# Altium schematic sheet THERMO_RTD_SENSOR_2CH.SchDoc: 2CH RTD Sensor
size A3; Author: M.Beldyga; CompanyName: WUT ISE; DrawnBy: M.Beldyga; Organization: WUT ISE; Address1: PW ISE; Address2: Nowowiejska 15/19 00-665 Warsaw; Address3: micbeldyga@gmail.com; SheetNumber: 1; SheetTotal: 2; ModifiedBy: -; CheckedDate: -; Title2: MODULIQ; DivGrp: WUT ISE; Designer: M.Beldyga; ModifiedDate: -; ProjectName: Sensor Box
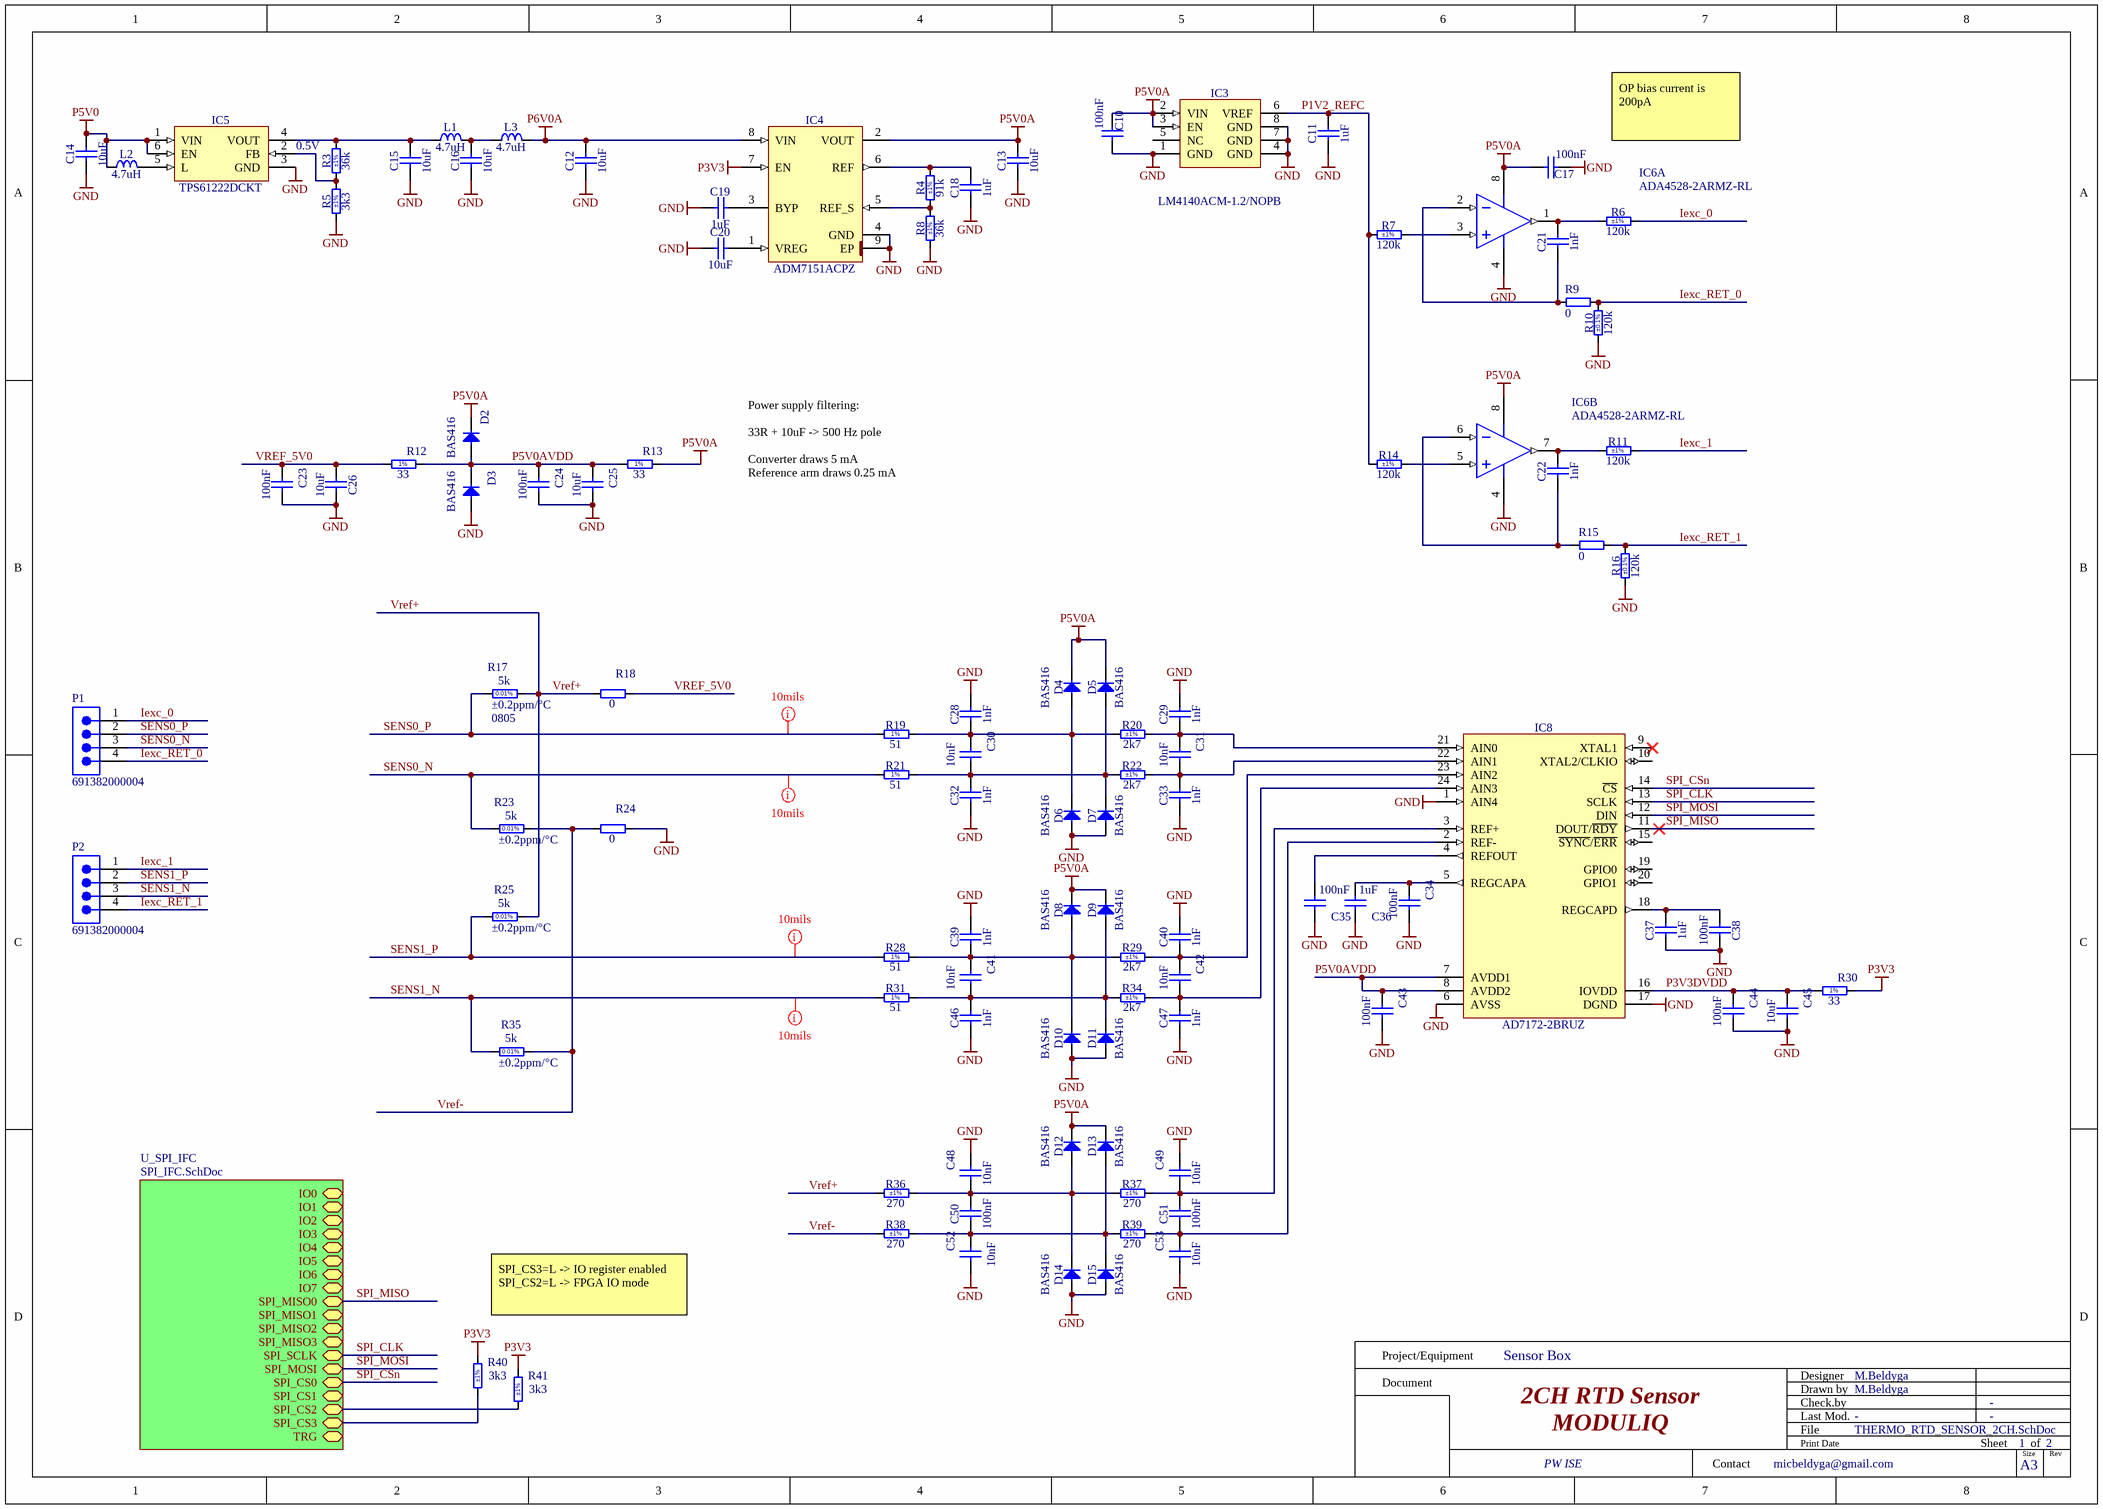
[diagram p0: THERMO_RTD_SENSOR_2CH.SchDoc]

## Parts
C10  100nF  [CAPC1005X55N]
C11  1uF  [CAPC1608X87N]
C12  10uF  [CAPC1608X80N]
C13  10uF  [CAPC1608X80N]
C14  10uF  [CAPC1608X80N]
C15  10uF  [CAPC1608X80N]
C16  10uF  [CAPC1608X80N]
C17  100nF  [CAPC1005X55N]
C18  1uF  [CAPC1005X55N]
C19  1uF  [CAPC1005X55N]
C20  10uF  [CAPC1608X80N]
C21  1nF  [CAPC1005X55N]
C22  1nF  [CAPC1005X55N]
C23  100nF  [CAPC1005X55N]
C24  100nF  [CAPC1005X55N]
C25  10uF  [CAPC2012X135N]
C26  10uF  [CAPC2012X135N]
C28  1nF  [CAPC1608X90N]
C29  1nF  [CAPC1608X90N]
C30  10nF  [CAPC1608X87N]
C31  10nF  [CAPC1608X87N]
C32  1nF  [CAPC1608X90N]
C33  1nF  [CAPC1608X90N]
C34  100nF  [CAPC1005X55N]
C35  100nF  [CAPC1005X55N]
C36  1uF  [CAPC1608X87N]
C37  1uF  [CAPC1608X87N]
C38  100nF  [CAPC1005X55N]
C39  1nF  [CAPC1608X90N]
C40  1nF  [CAPC1608X90N]
C41  10nF  [CAPC1608X87N]
C42  10nF  [CAPC1608X87N]
C43  100nF  [CAPC1005X55N]
C44  100nF  [CAPC1005X55N]
C45  10uF  [CAPC2012X135N]
C46  1nF  [CAPC1608X90N]
C47  1nF  [CAPC1608X90N]
C48  10nF  [CAPC1608X87N]
C49  10nF  [CAPC1608X87N]
C50  100nF  [CAPC1608X87N]
C51  100nF  [CAPC1608X87N]
C52  10nF  [CAPC1608X87N]
C53  10nF  [CAPC1608X87N]
D2  BAS416  [SOD2512X110N]
D3  BAS416  [SOD2512X110N]
D4  BAS416  [SOD2512X110N]
D5  BAS416  [SOD2512X110N]
D6  BAS416  [SOD2512X110N]
D7  BAS416  [SOD2512X110N]
D8  BAS416  [SOD2512X110N]
D9  BAS416  [SOD2512X110N]
D10  BAS416  [SOD2512X110N]
D11  BAS416  [SOD2512X110N]
D12  BAS416  [SOD2512X110N]
D13  BAS416  [SOD2512X110N]
D14  BAS416  [SOD2512X110N]
D15  BAS416  [SOD2512X110N]
IC3  LM4140ACM-1.2/NOPB  [SOIC127P600X175-8N]
IC4  ADM7151ACPZ  [SON50P300X300X80-9N-R170X244]
IC5  TPS61222DCKT  [SOT65P210X110-6N]
IC6  ADA4528-2ARMZ-RL  [ADI-RM-8_N]  (parts A,B of 2)
IC8  AD7172-2BRUZ  [SOP65P640X120-24N]
L1  4.7uH  [INDC2520X120N]
L2  4.7uH  [INDC2520X120N]
L3  4.7uH  [INDC2520X120N]
P1  691382000004  [691382000004]
P2  691382000004  [691382000004]
R3  36k  Tolerance: ±1%  [RESC1005X40N]
R4  91k  Tolerance: ±1%  [RESC1005X40N]
R5  3k3  Tolerance: ±1%  [RESC1005X40N]
R6  120k  Tolerance: ±1%  [RESC1005X40N]
R7  120k  Tolerance: ±1%  [RESC1005X40N]
R8  36k  Tolerance: ±1%  [RESC1005X40N]
R9  0  [RESC1005X40N]
R10  120k  Tolerance: ±0.1%  [RESC2012X60N]
R11  120k  Tolerance: ±1%  [RESC1005X40N]
R12  33  [RESC1005X40N]
R13  33  [RESC1005X40N]
R14  120k  Tolerance: ±1%  [RESC1005X40N]
R15  0  [RESC1005X40N]
R16  120k  Tolerance: ±0.1%  [RESC2012X60N]
R17  5k  TC: ±0.2ppm/°C  Case: 0805  [RESC2013X64N]
R18  0  [RESC1608X55N]
R19  51  [RESC1005X40N]
R20  2k7  Tolerance: ±1%  [RESC1005X40N]
R21  51  [RESC1005X40N]
R22  2k7  Tolerance: ±1%  [RESC1005X40N]
R23  5k  TC: ±0.2ppm/°C  [RESC2013X64N]
R24  0  [RESC1608X55N]
R25  5k  TC: ±0.2ppm/°C  [RESC2013X64N]
R28  51  [RESC1005X40N]
R29  2k7  Tolerance: ±1%  [RESC1005X40N]
R30  33  [RESC1005X40N]
R31  51  [RESC1005X40N]
R34  2k7  Tolerance: ±1%  [RESC1005X40N]
R35  5k  TC: ±0.2ppm/°C  [RESC2013X64N]
R36  270  Tolerance: ±1%  [RESC1005X40N]
R37  270  Tolerance: ±1%  [RESC1005X40N]
R38  270  Tolerance: ±1%  [RESC1005X40N]
R39  270  Tolerance: ±1%  [RESC1005X40N]
R40  3k3  Tolerance: ±1%  [RESC1005X40N]
R41  3k3  Tolerance: ±1%  [RESC1005X40N]

## Sub-sheets
U_SPI_IFC = SPI_IFC.SchDoc: IO0 (bidir), IO1 (bidir), IO2 (bidir), IO3 (bidir), IO4 (bidir), IO5 (bidir), IO6 (bidir), IO7 (bidir), SPI_MISO0 (bidir), SPI_MISO1 (bidir), SPI_MISO2 (bidir), SPI_MISO3 (bidir), SPI_SCLK (bidir), SPI_MOSI (bidir), SPI_CS0 (bidir), SPI_CS1 (bidir), SPI_CS2 (bidir), SPI_CS3 (bidir), TRG (bidir)

## Nets
GND: C10.2 C11.1 C12.1 C13.1 C14.1 C15.1 C16.1 C17.1 C18.1 C19.1 C20.1 C23.2 C24.2 C25.2 C26.2 C28.2 C29.2 C32.1 C33.1 C34.2 C35.2 C36.1 C37.1 C38.2 C39.2 C40.2 C43.2 C44.2 C45.2 C46.1 C47.1 C48.2 C49.2 C52.1 C53.1 D3.2(A) D6.2(A) D7.2(A) D10.2(A) D11.2(A) D14.2(A) D15.2(A) IC3.1(GND) IC3.4(GND) IC3.7(GND) IC3.8(GND) IC4.4(GND) IC4.9(EP) IC5.3(GND) IC6.4(-V) IC8.1(AIN4) IC8.6(AVSS) IC8.17(DGND) R5.1 R8.1 R10.1 R16.1 R24.2
P3V3: IC4.7(EN) R30.2 R40.1 R41.1
P5V0: C14.2 IC5.1(VIN) IC5.6(EN) L2.1
P5V0A: C10.1 C13.2 C17.2 D2.1(C) D4.1(C) D5.1(C) D8.1(C) D9.1(C) D12.1(C) D13.1(C) IC3.2(VIN) IC3.3(EN) IC4.2(VOUT) IC6.8(+V) R13.2
P6V0A: C12.2 IC4.8(VIN) L3.2
Iexc_0: P1.1 R6.2
Iexc_1: P2.1 R11.2
Iexc_RET_0: P1.4 R9.2 R10.2
Iexc_RET_1: P2.4 R15.2 R16.2
P1V2_REFC: C11.2 IC3.6(VREF) R7.1 R14.1
P3V3DVDD: C44.1 C45.1 IC8.16(IOVDD) R30.1
P5V0AVDD: C24.1 C25.1 C43.1 D2.2(A) D3.1(C) IC8.7(AVDD1) IC8.8(AVDD2) R12.2 R13.1
SENS0_N: P1.3 R21.1 R23.1
SENS0_P: P1.2 R17.1 R19.1
SENS1_N: P2.3 R31.1 R35.1
SENS1_P: P2.2 R25.1 R28.1
SPI_CLK: IC8.13(SCLK) ; sheet U_SPI_IFC/SPI_SCLK
SPI_CSn: IC8.14(~{CS}) ; sheet U_SPI_IFC/SPI_CS0
SPI_MISO: IC8.11(DOUT/~{RDY}) ; sheet U_SPI_IFC/SPI_MISO0
SPI_MOSI: IC8.12(DIN) ; sheet U_SPI_IFC/SPI_MOSI
Vref+: R17.2 R18.1 R25.2 R36.1
Vref-: R23.2 R24.1 R35.2 R38.1
VREF_5V0: C23.1 C26.1 R12.1 R18.2
NetC15_2: C15.2 IC5.4(VOUT) L1.1 R3.2
NetC16_2: C16.2 L1.2 L3.1
NetC18_2: C18.2 IC4.6(REF) R4.2
NetC19_2: C19.2 IC4.3(BYP)
NetC20_2: C20.2 IC4.1(VREG)
NetC21_1: C21.1 IC6.2(-IN_A) R9.1
NetC21_2: C21.2 IC6.1(OUT_A) R6.1
NetC22_1: C22.1 IC6.6(-IN_B) R15.1
NetC22_2: C22.2 IC6.7(OUT_B) R11.1
NetC28_1: C28.1 C30.1 D4.2(A) D6.1(C) R19.2 R20.1
NetC29_1: C29.1 C31.1 IC8.21(AIN0) R20.2
NetC30_2: C30.2 C32.2 D5.2(A) D7.1(C) R21.2 R22.1
NetC31_2: C31.2 C33.2 IC8.22(AIN1) R22.2
NetC34_1: C34.1 C36.2 IC8.5(REGCAPA)
NetC35_1: C35.1 IC8.4(REFOUT)
NetC37_2: C37.2 C38.1 IC8.18(REGCAPD)
NetC39_1: C39.1 C41.1 D8.2(A) D10.1(C) R28.2 R29.1
NetC40_1: C40.1 C42.1 IC8.23(AIN2) R29.2
NetC41_2: C41.2 C46.2 D9.2(A) D11.1(C) R31.2 R34.1
NetC42_2: C42.2 C47.2 IC8.24(AIN3) R34.2
NetC48_1: C48.1 C50.2 D12.2(A) D14.1(C) R36.2 R37.1
NetC49_1: C49.1 C51.2 IC8.3(REF+) R37.2
NetC50_1: C50.1 C52.2 D13.2(A) D15.1(C) R38.2 R39.1
NetC51_1: C51.1 C53.2 IC8.2(REF-) R39.2
NetIC4_5: IC4.5(REF_S) R4.1 R8.2
NetIC5_2: IC5.2(FB) R3.1 R5.2
NetIC5_5: IC5.5(L) L2.2
NetIC6_3: IC6.3(+IN_A) R7.2
NetIC6_5: IC6.5(+IN_B) R14.2
NetR40_2: R40.2 ; sheet U_SPI_IFC/SPI_CS3
NetR41_2: R41.2 ; sheet U_SPI_IFC/SPI_CS2

Not connected (* = marked no-connect by the designer): IC3 5(NC); IC8 9(XTAL1)* 10(XTAL2/CLKIO) 15(~{SYNC}/~{ERR}) 19(GPIO0) 20(GPIO1)

## Layout directives
rule Width Constraint [Pref Width = 10mil    Min Width = 10mil    Max Width = 15mil]: SENS0_N, SENS0_P, SENS1_N, SENS1_P

## Notes on the sheet
- 0.5V
- OP bias current is 200pA
- Power supply filtering:
  33R + 10uF -> 500 Hz pole
  Converter draws 5 mA
  Reference arm draws 0.25 mA
- SPI_CS3=L -> IO register enabled
  SPI_CS2=L -> FPGA IO mode
- Project/Equipment
- Document
- Designer
- Drawn by
- Check.by
- Contact
- File
- Last Mod.
- Print Date
- Sheet
- Size
- A3
- of
- Rev
- (in symbol R0402_33R_1%_0.0625W_100PPM) 1%
- (in symbol R0402_51R_1%_0.0625W_100PPM) 1%
- (in symbol R0805_5K_0.01%_0.2W_0.2PPM_VISHAY_VSMP) 0.01%

## Library data of the parts
C10 C17 = CC0402_100NF_16V_10%_X5R: Non-polarised capacitor; Part Description: SMD Multilayer Chip Ceramic Capacitor; Manufacturer: GENERIC; Manufacturer1 Part Number: GRM155R61C104KA88D; Voltage: 16V; TC: X5R; Tolerance: ±10%; Part Number: CC0402_100NF_16V_10%_X5R; Component Kind: Standard; Component Type: Standard; Pin Count: 2; Value: 100nF; Status: None; Manufacturer Part Number: CC0402_100NF_16V_10%_X5R; Case: 0402; Mounted: Yes; Socket: No; SMD: Yes; Sense: No; Manufacturer1 Example: MURATA; Manufacturer1 ComponentHeight: 0.55mm; HelpURL: \\cern.ch\dfs\Applications\Altium\Datasheets\CC0402_X5R_MURATA_GRM.pdf; Author: CERN DEM JLC; CreateDate: 10.12.2013; LatestRevisionDate: 10.12.2013
C11 C36 C37 = CC0603_1UF_25V_10%_X7R: Non-polarised capacitor; Part Description: SMD Multilayer Chip Ceramic Capacitor; Manufacturer: GENERIC; Manufacturer1 Part Number: GRM188R71E105KA12D; Voltage: 25V; TC: X7R; Tolerance: ±10%; Part Number: CC0603_1UF_25V_10%_X7R; Component Kind: Standard; Component Type: Standard; Pin Count: 2; Value: 1uF; Status: None; Manufacturer Part Number: CC0603_1UF_25V_10%_X7R; Case: 0603; Mounted: Yes; Socket: No; SMD: Yes; Sense: No; Manufacturer1 Example: MURATA; Manufacturer1 ComponentHeight: 0.9mm; HelpURL: \\cern.ch\dfs\Applications\Altium\Datasheets\CC0603_X7R_MURATA.pdf; Author: CERN DEM JLC; CreateDate: 18/01/2011; LatestRevisionDate: 18/01/2011
C12-C16 C20 = CC0603_10UF_10V_10%_X5R: Non-polarised capacitor; Part Description: SMD Multilayer Chip Ceramic Capacitor; Manufacturer: GENERIC; Manufacturer1 Part Number: GRM188R61A106KE69D; Voltage: 10V; TC: X5R; Tolerance: ±10%; Part Number: CC0603_10UF_10V_10%_X5R; Component Kind: Standard; Component Type: Standard; Pin Count: 2; Value: 10uF; Status: None; Manufacturer Part Number: CC0603_10UF_10V_10%_X5R; Case: 0603; Mounted: Yes; Socket: No; SMD: Yes; Sense: No; Manufacturer1 Example: MURATA; Manufacturer1 ComponentHeight: 0.8mm; HelpURL: \\cern.ch\dfs\Applications\Altium\Datasheets\CC0603_MURATA_GRM188R61A106KE69D.pdf; Author: CERN DEM JLC; CreateDate: 31.01.2017; LatestRevisionDate: 31.01.2017
C18 C19 = CC0402_1UF_16V_10%_X5R: Non-polarised capacitor; Part Description: SMD Multilayer Chip Ceramic Capacitor; Manufacturer: GENERIC; Manufacturer1 Part Number: C1005X5R1C105KT; Voltage: 16V; TC: X5R; Tolerance: ±10%; Part Number: CC0402_1UF_16V_10%_X5R; Component Kind: Standard; Component Type: Standard; Pin Count: 2; Value: 1uF; Status: Preferred; Manufacturer Part Number: CC0402_1UF_16V_10%_X5R; Case: 0402; Mounted: Yes; Socket: No; SMD: Yes; Sense: No; Manufacturer1 Example: TDK; Manufacturer1 ComponentHeight: 0.55mm; HelpURL: \\cern.ch\dfs\Applications\Altium\Datasheets\CC0402_X5R_TDK_C.pdf; Author: CERN DEM JLC; CreateDate: 25.10.2012; LatestRevisionDate: 25.10.2012
C21 C22 = CC0402_1NF_50V_10%_X7R: Non-polarised capacitor; Part Description: SMD Multilayer Chip Ceramic Capacitor; Manufacturer: GENERIC; Manufacturer1 Part Number: 223858715623; Voltage: 50V; TC: X7R; Tolerance: ±10%; Part Number: CC0402_1NF_50V_10%_X7R; Component Kind: Standard; Component Type: Standard; Pin Count: 2; Value: 1nF; Status: Not Recommended; Manufacturer Part Number: CC0402_1NF_50V_10%_X7R; Case: 0402; Mounted: Yes; Socket: No; SMD: Yes; Sense: No; Manufacturer1 Example: PHYCOMP; Manufacturer1 ComponentHeight: 0.55mm; HelpURL: \\cern.ch\dfs\Applications\Altium\Datasheets\CC0402_X7R_PHYCOMP.pdf; Author: CERN DEM JLC; CreateDate: 03/12/2007; LatestRevisionDate: 03/12/2007
C23 C24 C34 C35 C38 C43 C44 = CC0402_100NF_16V_10%_X5R: Non-polarised capacitor; Part Description: SMD Multilayer Chip Ceramic Capacitor; Manufacturer: GENERIC; Manufacturer1 Part Number: GRM155R61C104KA88D; Voltage: 16V; TC: X5R; Tolerance: ±10%; Table: Capacitors SMD; Part Number: CC0402_100NF_16V_10%_X5R; Component Kind: Standard; Component Type: Standard; Pin Count: 2; Value: 100nF; Status: None; Manufacturer Part Number: CC0402_100NF_16V_10%_X5R; Case: 0402; Mounted: Yes; Socket: No; SMD: Yes; Manufacturer1 Example: MURATA; Manufacturer1 ComponentHeight: 0.55mm; HelpURL: \\cern.ch\dfs\Applications\Altium\Datasheets\CC0402_X5R_MURATA_GRM.pdf; Author: CERN DEM JLC; CreateDate: 2013-12-10; LatestRevisionDate: 2013-12-10
C25 C26 C45 = CC0805_10UF_16V_10%_X5R: Non-polarised capacitor; Part Description: SMD Multilayer Chip Ceramic Capacitor; Manufacturer: GENERIC; Manufacturer1 Part Number: C0805C106K4PAC; Voltage: 16V; TC: X5R; Tolerance: ±10%; Part Number: CC0805_10UF_16V_10%_X5R; Component Kind: Standard; Component Type: Standard; Pin Count: 2; Value: 10uF; Status: Preferred; Manufacturer Part Number: CC0805_10UF_16V_10%_X5R; Case: 0805; Mounted: Yes; Socket: No; SMD: Yes; Manufacturer1 Example: KEMET; Manufacturer1 ComponentHeight: 1.4mm; HelpURL: \\cern.ch\dfs\Applications\Altium\Datasheets\CC1206_X5R_KEMET.pdf; Author: CERN DEM JLC; CreateDate: 03.12.2007; LatestRevisionDate: 03.12.2007; Sense: No
C28 C29 C32 C33 C39 C40 C46 C47 = CC0603_1NF_50V_5%_NP0: Non-polarised capacitor; Part Description: SMD Multilayer Chip Ceramic Capacitor; Manufacturer: GENERIC; Manufacturer1 Part Number: CC0603JRNPO9BN102; Voltage: 50V; TC: C0G/NP0; Tolerance: ±5%; Part Number: CC0603_1NF_50V_5%_NP0; Component Kind: Standard; Component Type: Standard; Pin Count: 2; Value: 1nF; Status: Preferred; Manufacturer Part Number: CC0603_1NF_50V_5%_NP0; Case: 0603; Mounted: Yes; Socket: No; SMD: Yes; Sense: No; Manufacturer1 Example: YAGEO PHYCOMP; Manufacturer1 ComponentHeight: 0.9mm; HelpURL: \\cern.ch\dfs\Applications\Altium\Datasheets\CC0805_NP0_PHYCOMP_16VTO50V.pdf; Author: CERN DEM JLC; CreateDate: 22.10.2012; LatestRevisionDate: 22.10.2012
C30 C31 C41 C42 C48 C49 C52 C53 = CC0603_10NF_50V_5%_C0G: Non-polarised capacitor; Part Description: SMD Multilayer Chip Ceramic Capacitor; Manufacturer: GENERIC; Manufacturer1 Part Number: C1608C0G1H103J080AA; Voltage: 50V; TC: C0G/NP0; Tolerance: ±5%; Part Number: CC0603_10NF_50V_5%_C0G; Component Kind: Standard; Component Type: Standard; Pin Count: 2; Value: 10nF; Status: Preferred; Manufacturer Part Number: CC0603_10NF_50V_5%_C0G; Case: 0603; Mounted: Yes; Socket: No; SMD: Yes; Manufacturer1 Example: TDK; Manufacturer1 ComponentHeight: 0.9mm; HelpURL: \\cern.ch\dfs\Applications\Altium\Datasheets\CC0603_C0G_TDK_C.pdf; Author: CERN DEM JLC; Sense: No
  C30 C31 C41 C42: CreateDate: 10.12.2014; LatestRevisionDate: 10.12.2014
  C48 C49 C52 C53: CreateDate: 10/12/2014; LatestRevisionDate: 10/12/2014
C50 C51 = CC0603_100NF_50V_10%_X5R: Non-polarised capacitor; Part Description: SMD Multilayer Chip Ceramic Capacitor; Manufacturer: GENERIC; Manufacturer1 Part Number: C1608X5R1H104K080; Voltage: 50V; TC: X5R; Tolerance: ±10%; Part Number: CC0603_100NF_50V_10%_X5R; Component Kind: Standard; Component Type: Standard; Pin Count: 2; Value: 100nF; Status: None; Manufacturer Part Number: CC0603_100NF_50V_10%_X5R; Case: 0603; Mounted: Yes; Socket: No; SMD: Yes; Sense: No; Manufacturer1 Example: TDK; Manufacturer1 ComponentHeight: 0.9mm; HelpURL: \\cern.ch\dfs\Applications\Altium\Datasheets\CC0603_X5R_TDK_C.pdf; Author: CERN DEM MR; CreateDate: 08.01.2016; LatestRevisionDate: 08.01.2016
D2-D15 = BAS416: Diode; Part Description: Low-Leakage Diode; Manufacturer: NXP SEMICONDUCTORS; Voltage: 75V; Power: 200mA; PressFit: No; Bonding: No; Part Number: BAS416; Component Kind: Standard; Component Type: Standard; Device: BAS416; PackageDescription: Small Outline Diode (SOD-323), 1.70mm W X 1.25mm L X 1.10mm H body,  IPC Medium Density; Manufacturer Part Number: BAS416; Pin Count: 2; Case: SOD323; Mounted: Yes; Socket: No; SMD: Yes; Sense: No; ComponentHeight: 1.1mm; HelpURL: \\cern.ch\dfs\Applications\Altium\Datasheets\BAS416.pdf; Author: CERN DEM JLC; CreateDate: 01/10/2013; LatestRevisionDate: 01/10/2013
IC3 = LM4140ACM-1.2/NOPB: High Precision Low Noise Low Dropout Voltage Reference; Part Description: 1.2V 0.1% 3 ppm/°C, High Precision Low Noise Low Dropout Voltage Reference; Manufacturer: TEXAS INSTRUMENTS; PressFit: No; Bonding: No; Part Number: LM4140ACM-1.2/NOPB; Component Kind: Standard; Component Type: Standard; Device: LM4140ACM-1.2/NOPB; PackageDescription: SOIC 8, Pitch 1.27mm, Body 4x5mm, IPC Medium Density; Manufacturer Part Number: LM4140ACM-1.2/NOPB; Pin Count: 8; Case: SOIC8; Mounted: Yes; Socket: No; SMD: Yes; Sense: No; ComponentHeight: 1.75mm; HelpURL: \\cern.ch\dfs\Applications\Altium\Datasheets\LM4140ACM-1.2-NOPB.pdf; Author: CERN DEM JLC; CreateDate: 17.11.2014; LatestRevisionDate: 17.11.2014
IC4 = ADM7151ACPZ: 800 mA Ultralow Noise, High PSRR, RF Linear Regulator; Part Description: Adjustable 1.5V to 5.1V, 800 mA Ultralow Noise, High PSRR, RF Linear Regulator; Manufacturer: ANALOG DEVICES; PressFit: No; Bonding: No; Part Number: ADM7151ACPZ; Component Kind: Standard; Component Type: Standard; Device: ADM7151ACPZ; PackageDescription: SON, (DFN) 0.50mm Pitch; 8 pin, 3.00mm W X 3.00mm L X 0.80mm H body (w/Thermal Tab 1.70 X2.44mm), IPC Medium Density; Manufacturer Part Number: ADM7151ACP; Pin Count: 9; Case: SON8; Mounted: Yes; Socket: No; SMD: Yes; Sense: No; ComponentHeight: 0.8mm; HelpURL: \\cern.ch\dfs\Applications\Altium\Datasheets\ADM7151ACPZ.pdf; Author: CERN DEM JLC; CreateDate: 23.04.2015; LatestRevisionDate: 31.03.2022
IC5 = TPS61222DCKT: Low Input Voltage, 0.7V Boost Converter With 5.5uA Quiescent Current; Manufacturer: TEXAS INSTRUMENTS; PressFit: No; Bonding: No; Part Number: TPS61222DCKT; Component Kind: Standard; Component Type: Standard; Device: TPS61222DCKT; PackageDescription: SOT353, SC70-6, 0.65mm Pitch; 6 Pin, 1.25mm W X 2.00mm L X 1.10mm H body, IPC Medium Density; Part Description: Low Input Voltage, 0.7V Boost Converter with 5.5uA Quiescent Current; Manufacturer Part Number: TPS61222DCK; Pin Count: 6; Case: SOT363; Mounted: Yes; Socket: No; SMD: Yes; Sense: No; ComponentHeight: 1.1mm; HelpURL: \\cern.ch\dfs\Applications\Altium\Datasheets\TPS61222DCKT.pdf; Author: CERN DEM BC; CreateDate: 27.02.2017; LatestRevisionDate: 13.06.2022
IC6 = CMP-0384-01794-1: Double Channel RRIO Operational Amplifier, 3.4 MHz BW, 500 mV/us SR, Industrial, 8-pin SOP (RM-8), Reel; Manufacturer: Analog Devices; V Span Max: 5.5V; Iq/Amp: 1.5mA; Amplifiers Per Package: 2; Input Bias Current: 125pA; V Span Min: 2.2V; Small Signal Bandwidth: 3.4MHz; Input Offset Voltage: 300nV; Code_JEDEC: MO-187-AA; PackageReference: RM-8; ComponentLink3Description: Package Specification; Slew Rate: 500mV/us; Manufacturer Part Number: ADA4528-2ARMZ-RL; ComponentLink2Description: Datasheet; Generic Part Number: ADA4528-2; DatasheetVersion: Rev. C; ComponentLink1URL: http://www.analog.com/en/index.html; Packing: Reel; ComponentLink3URL: http://www.analog.com/static/imported-files/packages/PKG_PDF/MSOP%28RM%29/RM_8.pdf; PackageDescription: 8-Pin Mini Small Outline Package, Body 3 x 3 mm, Pitch 0.65 mm; ComponentLink2URL: http://www.analog.com/static/imported-files/data_sheets/ADA4528-1_4528-2.pdf; ComponentLink1Description: Manufacturer URL; Mounting Technology: Surface Mount
IC8 = ADC_AD7172-2: 32-Bit, 10 kSPS, Sigma-Delta ADC with 100 µs Settling and True Rail-to-Rail Buffers; Part Description: Low Power, 24-Bit, 31.25 kSPS, Sigma-DeltaADC with True Rail-to-Rail Buffers; Manufacturer: ANALOG DEVICES; PressFit: No; Bonding: No; Part Number: AD7172-2BRUZ; Component Kind: Standard; Component Type: Standard; Device: AD7172-2BRUZ; PackageDescription: SOP, 0.65mm Pitch; 24 Pin, 4.40mm W X 5.00mm L X 1.20mm H Body IPC Medium Density; Manufacturer Part Number: AD7172-2BRUZ; Pin Count: 24; Case: TSSOP24; Mounted: Yes; Socket: No; SMD: Yes; Sense: No; ComponentHeight: 1.2mm; Author: GK; HelpURL: \\cern.ch\dfs\Applications\Altium\Datasheets\AD7177-2BRUZ.pdf; CreateDate: 14/12/2017; LatestRevisionDate: 14/12/2017
L1-L3 = IND1008_4.7UH_20%_MURATA_DFE252012P: Inductor; Part Description: Metal Alloy Power Inductor (DFE252012P Series); Manufacturer: MURATA; Manufacturer Part Number: DFE252012P-4R7M; Power: 2A; Resistance: 0.2R; Tolerance: ±20%; Part Number: IND1008_4.7UH_20%_MURATA_DFE252012P; Component Kind: Standard; Component Type: Standard; Pin Count: 2; Value: 4.7uH; Case: 1008; Mounted: Yes; Socket: No; SMD: Yes; Sense: No; ComponentHeight: 1.2mm; HelpURL: \\cern.ch\dfs\Applications\Altium\Datasheets\IND_MURATA_DFE252012P-4R7M.pdf; Author: CERN DEM BC; CreateDate: 03.09.2020; LatestRevisionDate: 03.09.2020
P1 P2 = 691382000004: WR-TBL Series 382 Vertical PCB Header, THT, pitch 2.5mm, 4p; Manufacturer: Wurth Elektronik; Modularity: No; Rated Current: 4A; Working Voltage: 300V; Manufacturer Part Number: 691382000004; Category: Terminal Blocks; Match Code: WR-TBL; ComponentLink1Description: Website Link; ComponentLink1URL: https://www.we-online.com/redexpert/article/691382000004?ad; ComponentLink2Description: Datasheet Link; ComponentLink2URL: https://www.we-online.com/redexpert/spec/691382000004?ad; Mount: Through Hole; Operating Temperature Max: 105°C; Operating Temperature Min: -40°C; Packaging: Box; Application: Pluggable; Number of Pins: 4; Number of Rows: 1; Orientation: Vertical; Pitch: 2.5mm
R3 R8 = R0402_36K_1%_0.0625W_100PPM: Resistor - 1%; Part Description: General Purpose Thick Film Chip Resistor; Manufacturer: GENERIC; Manufacturer1 Part Number: 232270673603L; TC: ±100ppm/°C; PressFit: No; Part Number: R0402_36K_1%_0.0625W_100PPM; Component Kind: Standard; Component Type: Standard; Pin Count: 2; Value: 36k; Status: Not Recommended; Power: 0.0625W; Manufacturer Part Number: R0402_36K_1%_0.0625W_100PPM; Case: 0402; Mounted: Yes; Sense: No; Socket: No; SMD: Yes; Manufacturer1 Example: YAGEO PHYCOMP; Manufacturer1 ComponentHeight: 0.4mm; HelpURL: \\cern.ch\dfs\Applications\Altium\Datasheets\R0402_Phycomp_RC0402.pdf; Author: CERN DEM JLC; CreateDate: 03.12.2007; LatestRevisionDate: 17.10.2012
R4 = R0402_91K_1%_0.0625W_100PPM: Resistor - 1%; Part Description: General Purpose Thick Film Chip Resistor; Manufacturer: GENERIC; Manufacturer1 Part Number: 232270679103L; TC: ±100ppm/°C; PressFit: No; Part Number: R0402_91K_1%_0.0625W_100PPM; Component Kind: Standard; Component Type: Standard; Pin Count: 2; Value: 91k; Status: Not Recommended; Power: 0.0625W; Manufacturer Part Number: R0402_91K_1%_0.0625W_100PPM; Case: 0402; Mounted: Yes; Sense: No; Socket: No; SMD: Yes; Manufacturer1 Example: YAGEO PHYCOMP; Manufacturer1 ComponentHeight: 0.4mm; HelpURL: \\cern.ch\dfs\Applications\Altium\Datasheets\R0402_Phycomp_RC0402.pdf; Author: CERN DEM JLC; CreateDate: 03.12.2007; LatestRevisionDate: 17.10.2012
R5 R40 R41 = R0402_3K3_1%_0.0625W_100PPM: Resistor - 1%; Part Description: General Purpose Thick Film Chip Resistor; Manufacturer: GENERIC; Manufacturer1 Part Number: 232270673302L; TC: ±100ppm/°C; PressFit: No; Part Number: R0402_3K3_1%_0.0625W_100PPM; Component Kind: Standard; Component Type: Standard; Pin Count: 2; Value: 3k3; Status: Not Recommended; Power: 0.0625W; Manufacturer Part Number: R0402_3K3_1%_0.0625W_100PPM; Case: 0402; Mounted: Yes; Sense: No; Socket: No; SMD: Yes; Manufacturer1 Example: YAGEO PHYCOMP; Manufacturer1 ComponentHeight: 0.4mm; HelpURL: \\cern.ch\dfs\Applications\Altium\Datasheets\R0402_Phycomp_RC0402.pdf; Author: CERN DEM JLC; CreateDate: 03.12.2007; LatestRevisionDate: 17.10.2012
R6 R7 R11 R14 = R0402_120K_1%_0.0625W_100PPM: Resistor - 1%; Part Description: General Purpose Thick Film Chip Resistor; Manufacturer: GENERIC; Manufacturer1 Part Number: 232270671204L; TC: ±100ppm/°C; PressFit: No; Part Number: R0402_120K_1%_0.0625W_100PPM; Component Kind: Standard; Component Type: Standard; Pin Count: 2; Value: 120k; Status: Not Recommended; Power: 0.0625W; Manufacturer Part Number: R0402_120K_1%_0.0625W_100PPM; Case: 0402; Mounted: Yes; Sense: No; Socket: No; SMD: Yes; Manufacturer1 Example: YAGEO PHYCOMP; Manufacturer1 ComponentHeight: 0.4mm; HelpURL: \\cern.ch\dfs\Applications\Altium\Datasheets\R0402_Phycomp_RC0402.pdf; Author: CERN DEM JLC; CreateDate: 03.12.2007; LatestRevisionDate: 17.10.2012
R9 R15 = R0402_0R_JUMPER: Resistor; Part Description: 1A (0.05R Max DC Resistance) Zero Ohm Jumper; Manufacturer: GENERIC; Manufacturer1 Part Number: 232270591001L; PressFit: No; Part Number: R0402_0R_JUMPER; Component Kind: Standard; Component Type: Standard; Pin Count: 2; Value: 0; Status: Not Recommended; Manufacturer Part Number: R0402_0R_JUMPER; Case: 0402; Mounted: Yes; Sense: No; Socket: No; SMD: Yes; Manufacturer1 Example: YAGEO PHYCOMP; Manufacturer1 ComponentHeight: 0.4mm; HelpURL: \\cern.ch\dfs\Applications\Altium\Datasheets\R0402_Phycomp_RC0402.pdf; Author: CERN DEM JLC; CreateDate: 12/3/2007; LatestRevisionDate: 10/17/2012
R10 R16 = R0805_120K_0.1%_0.125W_25PPM: Resistor - 0.1%; Part Description: Thin Film Chip Resistor; Manufacturer: GENERIC; Manufacturer1 Part Number: ERA6AEB124V; Power: 0.125W; TC: ±25ppm; PressFit: No; Part Number: R0805_120K_0.1%_0.125W_25PPM; Component Kind: Standard; Component Type: Standard; Pin Count: 2; Value: 120k; Status: Not Recommended; Manufacturer Part Number: R0805_120K_0.1%_0.125W_25PPM; Case: 0805; Mounted: Yes; Sense: No; Socket: No; SMD: Yes; Manufacturer1 Example: PANASONIC; Manufacturer1 ComponentHeight: 0.6mm; HelpURL: \\cern.ch\dfs\Applications\Altium\Datasheets\R0805_PANASONIC_ERA.pdf; Author: CERN DEM JLC; CreateDate: 04.06.2015; LatestRevisionDate: 04.06.2015
R12 R13 R30 = R0402_33R_1%_0.0625W_100PPM: Resistor - 1%; Part Description: General Purpose Thick Film Chip Resistor; Manufacturer: GENERIC; Manufacturer1 Part Number: 232270673309L; TC: ±100ppm/°C; PressFit: No; Part Number: R0402_33R_1%_0.0625W_100PPM; Component Kind: Standard; Component Type: Standard; Pin Count: 2; Value: 33; Status: Not Recommended; Power: 0.0625W; Tolerance: ±1%; Manufacturer Part Number: R0402_33R_1%_0.0625W_100PPM; Case: 0402; Mounted: Yes; Sense: No; Socket: No; SMD: Yes; Manufacturer1 Example: YAGEO PHYCOMP; Manufacturer1 ComponentHeight: 0.4mm; HelpURL: \\cern.ch\dfs\Applications\Altium\Datasheets\R0402_Phycomp_RC0402.pdf; Author: CERN DEM JLC; CreateDate: 03/12/2007; LatestRevisionDate: 17/10/2012
R17 R23 R25 R35 = R0805_5K_0.01%_0.2W_0.2PPM_VISHAY_VSMP: Resistor - 0.01%; Part Description: Ultra High Precision Foil Wraparound Surface Mount Chip Resistor; Manufacturer: VISHAY PRECISION; Manufacturer Part Number: Y16245K00000T9R; Power: 0.2W; PressFit: No; Part Number: R0805_5K_0.01%_0.2W_0.2PPM_VISHAY_VSMP; Component Kind: Standard; Component Type: Standard; Pin Count: 2; Value: 5k; Status: None; Tolerance: ±0.01%; Mounted: Yes; Sense: No; Socket: No; SMD: Yes; Manufacturer1 ComponentHeight: 0.64mm; HelpURL: \\cern.ch\dfs\Applications\Altium\Datasheets\R0805_VISHAY_VSMP.pdf; Author: CERN DEM JLC; CreateDate: 22.09.2011; LatestRevisionDate: 22.09.2011
  R23 R25 R35: Case: 0805
R18 R24 = R0603_0R_JUMPER: Resistor; Part Description: 1A (0.05R Max DC Resistance) Zero Ohm Jumper; Manufacturer: GENERIC; Manufacturer1 Part Number: NRC06Z0; PressFit: No; Part Number: R0603_0R_JUMPER; Component Kind: Standard; Component Type: Standard; Pin Count: 2; Value: 0; Status: Preferred; Manufacturer Part Number: R0603_0R_JUMPER; Case: 0603; Mounted: Yes; Sense: No; Socket: No; SMD: Yes; Manufacturer1 Example: NIC COMPONENT; Manufacturer1 ComponentHeight: 0.55mm; HelpURL: \\cern.ch\dfs\Applications\Altium\Datasheets\R0603_NIC_NRC.pdf; Author: CERN DEM JLC; CreateDate: 03.12.2007; LatestRevisionDate: 13.03.2008
R19 R21 R28 R31 = R0402_51R_1%_0.0625W_100PPM: Resistor - 1%; Part Description: General Purpose Thick Film Chip Resistor; Manufacturer: GENERIC; Manufacturer1 Part Number: 232270675109L; TC: ±100ppm/°C; PressFit: No; Part Number: R0402_51R_1%_0.0625W_100PPM; Component Kind: Standard; Component Type: Standard; Pin Count: 2; Value: 51; Status: Not Recommended; Power: 0.0625W; Tolerance: ±1%; Manufacturer Part Number: R0402_51R_1%_0.0625W_100PPM; Case: 0402; Mounted: Yes; Sense: No; Socket: No; SMD: Yes; Manufacturer1 Example: YAGEO PHYCOMP; Manufacturer1 ComponentHeight: 0.4mm; HelpURL: \\cern.ch\dfs\Applications\Altium\Datasheets\R0402_Phycomp_RC0402.pdf; Author: CERN DEM JLC; CreateDate: 03/12/2007; LatestRevisionDate: 17/10/2012
R20 R22 R29 R34 = R0402_2K4_1%_0.0625W_100PPM: Resistor - 1%; Part Number: R0402_2K7_1%_0.0625W_100PPM; Part Description: General Purpose Thick Film Chip Resistor; Manufacturer: GENERIC; Manufacturer1 Part Number: 232270672702L; TC: ±100ppm/°C; PressFit: No; Component Kind: Standard; Component Type: Standard; Pin Count: 2; Value: 2k7; Status: Not Recommended; Power: 0.0625W; Manufacturer Part Number: R0402_2K7_1%_0.0625W_100PPM; Case: 0402; Mounted: Yes; Sense: No; Socket: No; SMD: Yes; Manufacturer1 Example: YAGEO PHYCOMP; Manufacturer1 ComponentHeight: 0.4mm; HelpURL: \\cern.ch\dfs\Applications\Altium\Datasheets\R0402_Phycomp_RC0402.pdf; Author: CERN DEM JLC; CreateDate: 03.12.2007; LatestRevisionDate: 17.10.2012
R36-R39 = R0402_270R_1%_0.0625W_100PPM: Resistor - 1%; Part Description: General Purpose Thick Film Chip Resistor; Manufacturer: GENERIC; Manufacturer1 Part Number: 232270672701L; TC: ±100ppm/°C; PressFit: No; Part Number: R0402_270R_1%_0.0625W_100PPM; Component Kind: Standard; Component Type: Standard; Pin Count: 2; Value: 270; Status: Not Recommended; Power: 0.0625W; Manufacturer Part Number: R0402_270R_1%_0.0625W_100PPM; Case: 0402; Mounted: Yes; Sense: No; Socket: No; SMD: Yes; Manufacturer1 Example: YAGEO PHYCOMP; Manufacturer1 ComponentHeight: 0.4mm; HelpURL: \\cern.ch\dfs\Applications\Altium\Datasheets\R0402_Phycomp_RC0402.pdf; Author: CERN DEM JLC; CreateDate: 03.12.2007; LatestRevisionDate: 17.10.2012